# Altium schematic sheet Sheet4.SchDoc
size A4
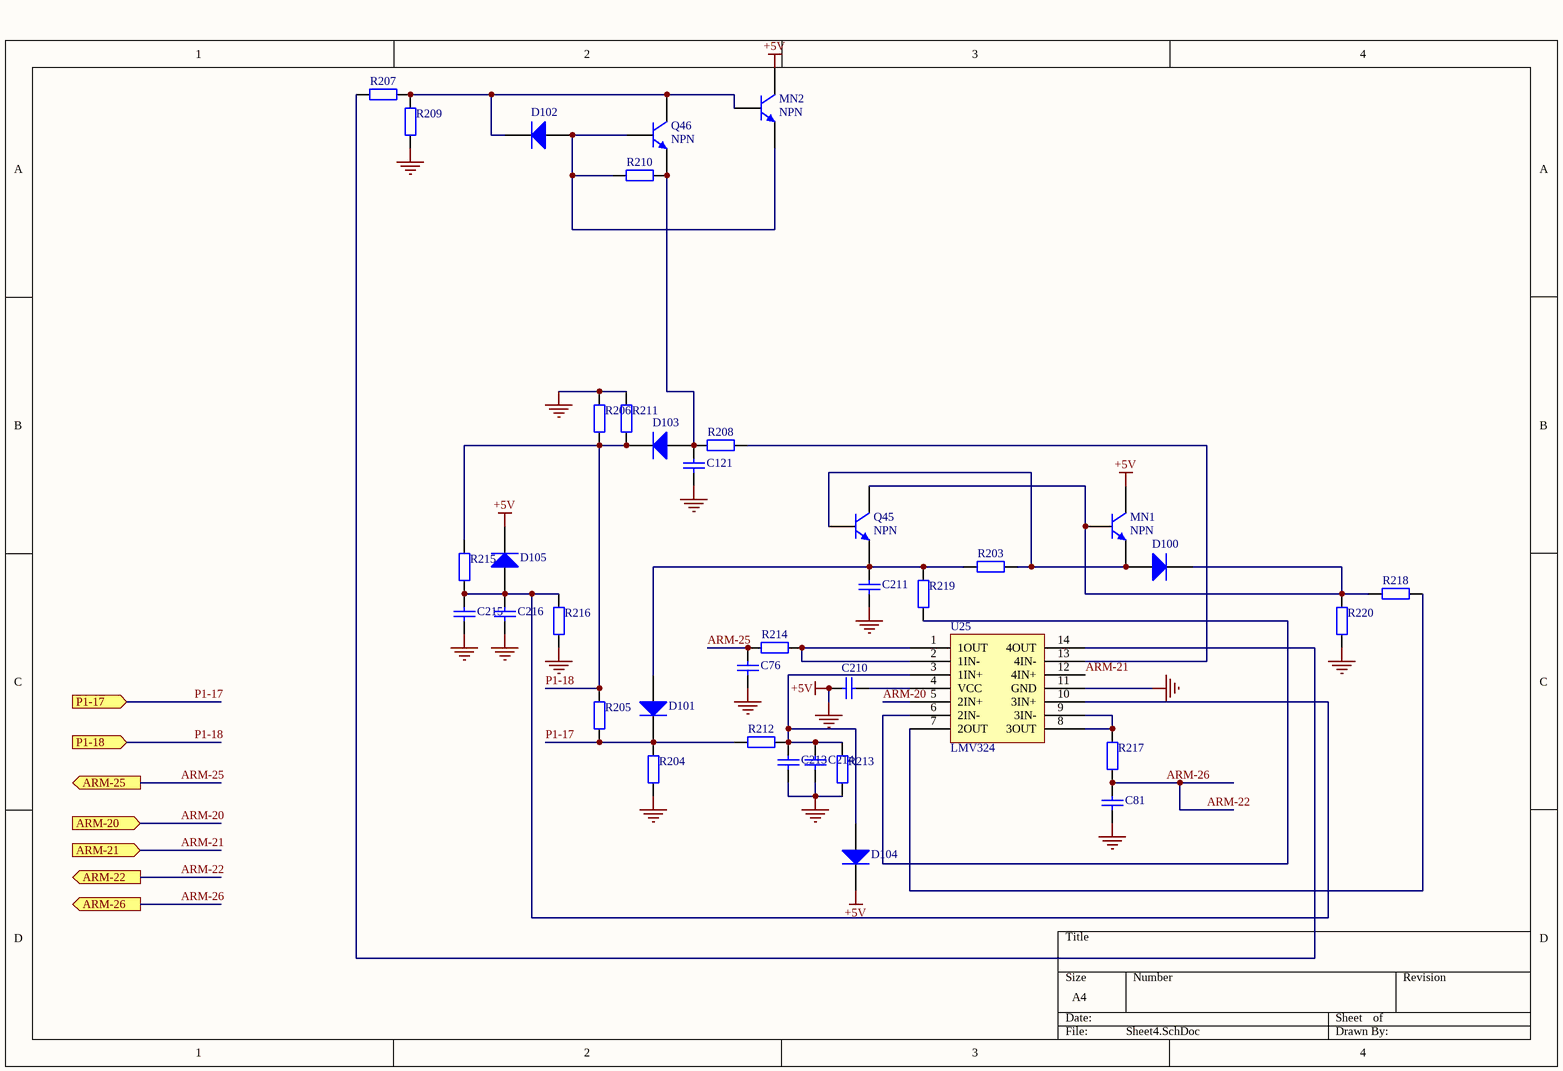
[diagram p0: Sheet4.SchDoc]

## Parts
C76  Cap  [RAD-0.3]  (value not drawn)
C81  Cap  [RAD-0.3]  (value not drawn)
C121  Cap  [RAD-0.3]  (value not drawn)
C210  Cap  [RAD-0.3]  (value not drawn)
C211  Cap  [RAD-0.3]  (value not drawn)
C213  Cap  [RAD-0.3]  (value not drawn)
C214  Cap  [RAD-0.3]  (value not drawn)
C215  Cap  [RAD-0.3]  (value not drawn)
C216  Cap  [RAD-0.3]  (value not drawn)
D100  Diode 1N4007  [DO-41]  (value not drawn)
D101  Diode 1N4007  [DO-41]  (value not drawn)
D102  Diode 1N4007  [DO-41]  (value not drawn)
D103  Diode 1N4007  [DO-41]  (value not drawn)
D104  Diode 1N4007  [DO-41]  (value not drawn)
D105  Diode 1N4007  [DO-41]  (value not drawn)
MN1  NPN  [TO-226]
MN2  NPN  [TO-226]
Q45  NPN  [TO-226]
Q46  NPN  [TO-226]
R203  Res2  [AXIAL-0.4]  (value not drawn)
R204  Res2  [AXIAL-0.4]  (value not drawn)
R205  Res2  [AXIAL-0.4]  (value not drawn)
R206  Res2  [AXIAL-0.4]  (value not drawn)
R207  Res2  [AXIAL-0.4]  (value not drawn)
R208  Res2  [AXIAL-0.4]  (value not drawn)
R209  Res2  [AXIAL-0.4]  (value not drawn)
R210  Res2  [AXIAL-0.4]  (value not drawn)
R211  Res2  [AXIAL-0.4]  (value not drawn)
R212  Res2  [AXIAL-0.4]  (value not drawn)
R213  Res2  [AXIAL-0.4]  (value not drawn)
R214  Res2  [AXIAL-0.4]  (value not drawn)
R215  Res2  [AXIAL-0.4]  (value not drawn)
R216  Res2  [AXIAL-0.4]  (value not drawn)
R217  Res2  [AXIAL-0.4]  (value not drawn)
R218  Res2  [AXIAL-0.4]  (value not drawn)
R219  Res2  [AXIAL-0.4]  (value not drawn)
R220  Res2  [AXIAL-0.4]  (value not drawn)
U25  LMV324

## Ports
ARM-20 (in), ARM-21 (in), ARM-22 (out), ARM-25 (out), ARM-26 (out), P1-17 (in), P1-18 (in)

## Nets
+5V: C76.1 C81.1 C121.2 C210.2 C211.1 C213.2 C214.2 C215.2 C216.2 D104.2(K) D105.2(K) MN1.1(C) MN2.1(C) R204.2 R206.1 R209.1 R211.1 R213.2 R216.2 R220.2 U25.11(GND)  [also labelled GND]
ARM-20: U25.5(2IN+) ; port ARM-20
ARM-21: U25.12(4IN+) ; port ARM-21
ARM-22: C81.2 R217.1 ; port ARM-22, port ARM-26  [also labelled ARM-26]
ARM-25: C76.2 R214.2 ; port ARM-25
P1-17: D101.2(K) R204.1 R205.2 R212.2 ; port P1-17
P1-18: D103.2(K) R205.1 R206.2 R211.2 R215.1 ; port P1-18
NetC121_1: C121.1 D103.1(A) Q46.3(E) R208.1 R210.2
NetC210_1: C210.1 U25.4(VCC)
NetC211_2: C211.2 D101.1(A) Q45.3(E) R203.2 R219.1
NetC213_1: C213.1 C214.1 D104.1(A) R212.1 R213.1 U25.3(1IN+)
NetC215_1: C215.1 C216.1 D105.1(A) R215.2 R216.1 U25.10(3IN+)
NetD100_1: D100.1(A) MN1.3(E) Q45.2(B) R203.1
NetD100_2: D100.2(K) MN1.2(B) Q45.1(C) R218.2 R220.1
NetD102_1: D102.1(A) MN2.3(E) Q46.2(B) R210.1
NetD102_2: D102.2(K) MN2.2(B) Q46.1(C) R207.2 R209.2
NetR207_1: R207.1 U25.14(4OUT)
NetR208_2: R208.2 U25.13(4IN-)
NetR214_1: R214.1 U25.1(1OUT) U25.2(1IN-)
NetR217_2: R217.2 U25.8(3OUT) U25.9(3IN-)
NetR218_1: R218.1 U25.7(2OUT)
NetR219_2: R219.2 U25.6(2IN-)

## Library data of the parts
C76 C81 C121 C210 C211 C213-C216 = Cap: Capacitor; Value: 100pF; Published: 8-Jun-2000; LatestRevisionDate: 17-Jul-2002; LatestRevisionNote: Re-released for DXP Platform.; PackageReference: RAD-0.3; Publisher: Altium Limited
D100-D105 = Diode 1N4007: 1 Amp General Purpose Rectifier; Published: 8-Jun-2000; LatestRevisionDate: 17-Jul-2002; LatestRevisionNote: Re-released for DXP Platform.; DatasheetDocument: 1998; PackageDocument: Aug-1999; PackageReference: DO-41; Publisher: Altium Limited; Code_JEDEC: DO-204-AL; ComponentLink1Description: Manufacturer Link; ComponentLink1URL: http://www.fairchildsemi.com/; ComponentLink2Description: Datasheet; ComponentLink2URL: http://www.fairchildsemi.com/ds/1N%2F1N4001.pdf
MN1 MN2 Q45 Q46 = NPN: NPN Bipolar Transistor; Published: 8-Jun-2000; LatestRevisionDate: 17-Jul-2002; LatestRevisionNote: Re-released for DXP Platform.; PackageReference: TO-226; Publisher: Altium Limited; Code_JEDEC: TO-226-AA
R203-R220 = Res2: Resistor; Value: 1K; Published: 8-Jun-2000; LatestRevisionDate: 17-Jul-2002; LatestRevisionNote: Re-released for DXP Platform.; PackageReference: AXIAL-0.4; Publisher: Altium Limited
U25 = Component_1